# EAGLE design Bus Controller (EAGLE 5.01)
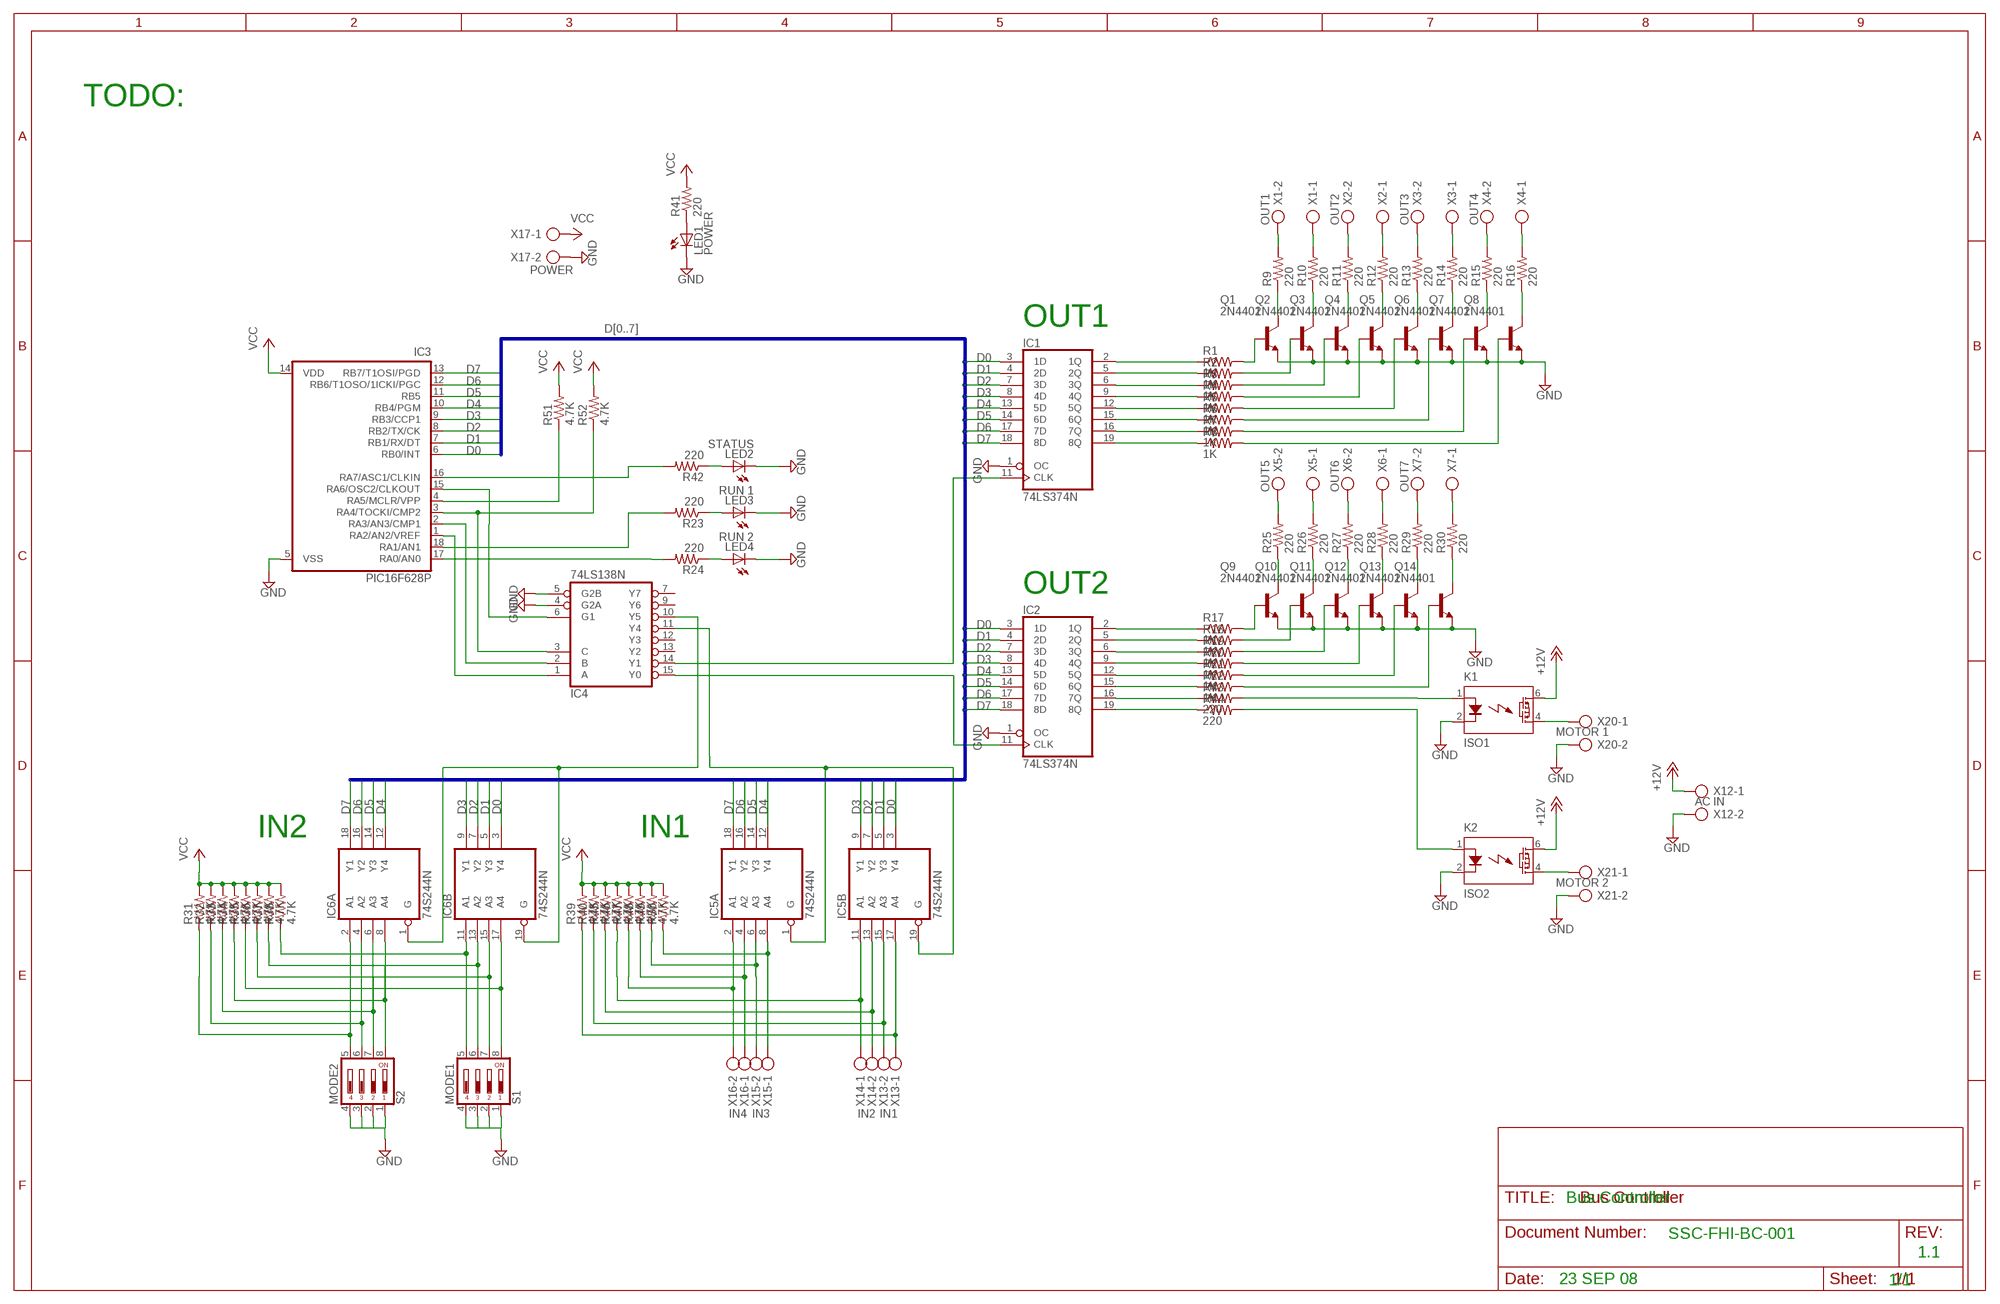
[diagram p0: schematic, sheet 1]

## Parts
IC1  74LS374N  [DIL20]
IC2  74LS374N  [DIL20]
IC3  PIC16F628P  [DIL18]
IC4  74LS138N  [DIL16]
IC5  74S244N  [DIL20]
IC6  74S244N  [DIL20]
K1  ISO1  LCA110  [DIL06]
K2  ISO2  LCA110  [DIL06]
LED1  POWER  LED5MM  [LED5MM]
LED2  STATUS  LED5MM  [LED5MM]
LED3  RUN 1  LED5MM  [LED5MM]
LED4  RUN 2  LED5MM  [LED5MM]
Q1  2N4401  [TO92-CBE]
Q2  2N4401  [TO92-CBE]
Q3  2N4401  [TO92-CBE]
Q4  2N4401  [TO92-CBE]
Q5  2N4401  [TO92-CBE]
Q6  2N4401  [TO92-CBE]
Q7  2N4401  [TO92-CBE]
Q8  2N4401  [TO92-CBE]
Q9  2N4401  [TO92-CBE]
Q10  2N4401  [TO92-CBE]
Q11  2N4401  [TO92-CBE]
Q12  2N4401  [TO92-CBE]
Q13  2N4401  [TO92-CBE]
Q14  2N4401  [TO92-CBE]
R1  1K  R-US_0207/2V  [0207/2V]
R2  1K  R-US_0207/2V  [0207/2V]
R3  1K  R-US_0207/2V  [0207/2V]
R4  1K  R-US_0207/2V  [0207/2V]
R5  1K  R-US_0207/2V  [0207/2V]
R6  1K  R-US_0207/2V  [0207/2V]
R7  1K  R-US_0207/2V  [0207/2V]
R8  1K  R-US_0207/2V  [0207/2V]
R9  220  R-US_0207/2V  [0207/2V]
R10  220  R-US_0207/2V  [0207/2V]
R11  220  R-US_0207/2V  [0207/2V]
R12  220  R-US_0207/2V  [0207/2V]
R13  220  R-US_0207/2V  [0207/2V]
R14  220  R-US_0207/2V  [0207/2V]
R15  220  R-US_0207/2V  [0207/2V]
R16  220  R-US_0207/2V  [0207/2V]
R17  1K  R-US_0207/2V  [0207/2V]
R18  1K  R-US_0207/2V  [0207/2V]
R19  1K  R-US_0207/2V  [0207/2V]
R20  1K  R-US_0207/2V  [0207/2V]
R21  1K  R-US_0207/2V  [0207/2V]
R22  1K  R-US_0207/2V  [0207/2V]
R23  220  R-US_0207/2V  [0207/2V]
R24  220  R-US_0207/2V  [0207/2V]
R25  220  R-US_0207/2V  [0207/2V]
R26  220  R-US_0207/2V  [0207/2V]
R27  220  R-US_0207/2V  [0207/2V]
R28  220  R-US_0207/2V  [0207/2V]
R29  220  R-US_0207/2V  [0207/2V]
R30  220  R-US_0207/2V  [0207/2V]
R31  4.7K  R-US_0207/2V  [0207/2V]
R32  4.7K  R-US_0207/2V  [0207/2V]
R33  4.7K  R-US_0207/2V  [0207/2V]
R34  4.7K  R-US_0207/2V  [0207/2V]
R35  4.7K  R-US_0207/2V  [0207/2V]
R36  4.7K  R-US_0207/2V  [0207/2V]
R37  4.7K  R-US_0207/2V  [0207/2V]
R38  4.7K  R-US_0207/2V  [0207/2V]
R39  4.7K  R-US_0207/2V  [0207/2V]
R40  4.7K  R-US_0207/2V  [0207/2V]
R41  220  R-US_0207/2V  [0207/2V]
R42  220  R-US_0207/2V  [0207/2V]
R43  220  R-US_0207/2V  [0207/2V]
R44  220  R-US_0207/2V  [0207/2V]
R45  4.7K  R-US_0207/2V  [0207/2V]
R46  4.7K  R-US_0207/2V  [0207/2V]
R47  4.7K  R-US_0207/2V  [0207/2V]
R48  4.7K  R-US_0207/2V  [0207/2V]
R49  4.7K  R-US_0207/2V  [0207/2V]
R50  4.7K  R-US_0207/2V  [0207/2V]
R51  4.7K  R-US_0207/2V  [0207/2V]
R52  4.7K  R-US_0207/2V  [0207/2V]
S1  MODE1  DS04  [DS-04]
S2  MODE2  DS04  [DS-04]
X1  OUT1  AK500/2  [AK500/2]
X2  OUT2  AK500/2  [AK500/2]
X3  OUT3  AK500/2  [AK500/2]
X4  OUT4  AK500/2  [AK500/2]
X5  OUT5  AK500/2  [AK500/2]
X6  OUT6  AK500/2  [AK500/2]
X7  OUT7  AK500/2  [AK500/2]
X12  AC IN  AK500/2  [AK500/2]
X13  IN1  AK500/2  [AK500/2]
X14  IN2  AK500/2  [AK500/2]
X15  IN3  AK500/2  [AK500/2]
X16  IN4  AK500/2  [AK500/2]
X17  POWER  AK500/2  [AK500/2]
X20  MOTOR 1  AK500/2  [AK500/2]
X21  MOTOR 2  AK500/2  [AK500/2]

## Nets
+12V: K1.6(D1) K2.6(D1) X12.1
A0: IC3.1(RA2/AN2/VREF) IC4.1(A)
A1: IC3.2(RA3/AN3/CMP1) IC4.2(B)
A2: IC3.3(RA4/TOCKI/CMP2) IC4.3(C) R52.1
ADDR_EN: IC3.15(RA6/OSC2/CLKOUT) IC4.6(G1)
D0: IC1.3(1D) IC2.3(1D) IC3.6(RB0/INT) IC5.3(B:Y4) IC6.3(B:Y4)
D1: IC1.4(2D) IC2.4(2D) IC3.7(RB1/RX/DT) IC5.5(B:Y3) IC6.5(B:Y3)
D2: IC1.7(3D) IC2.7(3D) IC3.8(RB2/TX/CK) IC5.7(B:Y2) IC6.7(B:Y2)
D3: IC1.8(4D) IC2.8(4D) IC3.9(RB3/CCP1) IC5.9(B:Y1) IC6.9(B:Y1)
D4: IC1.13(5D) IC2.13(5D) IC3.10(RB4/PGM) IC5.12(A:Y4) IC6.12(A:Y4)
D5: IC1.14(6D) IC2.14(6D) IC3.11(RB5) IC5.14(A:Y3) IC6.14(A:Y3)
D6: IC1.17(7D) IC2.17(7D) IC3.12(RB6/T1OSO/1ICKI/PGC) IC5.16(A:Y2) IC6.16(A:Y2)
D7: IC1.18(8D) IC2.18(8D) IC3.13(RB7/T1OSI/PGD) IC5.18(A:Y1) IC6.18(A:Y1)
GND: IC1.1(OC) IC2.1(OC) IC3.5(VSS) IC4.4(G2A) IC4.5(G2B) K1.2(K) K2.2(K) LED1.K(C) LED2.K(C) LED3.K(C) LED4.K(C) Q1.E Q2.E Q3.E Q4.E Q5.E Q6.E Q7.E Q8.E Q9.E Q10.E Q11.E Q12.E Q13.E Q14.E S1.1 S1.2 S1.3 S1.4 S2.1 S2.2 S2.3 S2.4 X12.2 X17.2 X20.2 X21.2
IN1: IC5.8(A:A4) R50.1 X15.1
IN2: IC5.6(A:A3) R49.1 X15.2
IN3: IC5.4(A:A2) R48.1 X16.1
IN4: IC5.2(A:A1) R47.1 X16.2
IN5: IC5.17(B:A4) R39.1 X13.1
IN6: IC5.15(B:A3) R40.1 X13.2
IN7: IC5.13(B:A2) R45.1 X14.2
IN8: IC5.11(B:A1) R46.1 X14.1
IN9: IC6.8(A:A4) R34.1 S2.8
IN10: IC6.6(A:A3) R33.1 S2.7
IN11: IC6.4(A:A2) R32.1 S2.6
IN12: IC6.2(A:A1) R31.1 S2.5
IN13: IC6.17(B:A4) R35.1 S1.8
IN14: IC6.15(B:A3) R36.1 S1.7
IN15: IC6.13(B:A2) R37.1 S1.6
IN16: IC6.11(B:A1) R38.1 S1.5
N$1: IC3.18(RA1/AN1) R23.2
N$2: IC3.4(RA5/MCLR/VPP) R51.1
N$5: IC2.11(CLK) IC4.15(Y0)
N$6: IC1.11(CLK) IC4.14(Y1)
N$7: Q1.B R1.2
N$8: Q2.B R2.2
N$9: Q3.B R3.2
N$10: Q4.B R4.2
N$11: Q5.B R5.2
N$12: Q6.B R6.2
N$13: Q7.B R7.2
N$14: Q8.B R8.2
N$15: Q1.C R9.1
N$16: Q2.C R10.1
N$17: Q3.C R11.1
N$18: Q4.C R12.1
N$19: Q5.C R13.1
N$20: Q6.C R14.1
N$21: Q7.C R15.1
N$22: Q8.C R16.1
N$23: IC1.2(1Q) R1.1
N$24: IC1.5(2Q) R2.1
N$25: IC1.6(3Q) R3.1
N$26: IC1.9(4Q) R4.1
N$27: IC1.12(5Q) R5.1
N$28: IC1.15(6Q) R6.1
N$29: IC1.16(7Q) R7.1
N$30: IC1.19(8Q) R8.1
N$31: Q9.B R17.2
N$32: Q10.B R18.2
N$33: Q11.B R19.2
N$34: Q12.B R20.2
N$35: Q13.B R21.2
N$36: Q14.B R22.2
N$37: LED4.A R24.1
N$38: LED3.A R23.1
N$39: R9.2 X1.2
N$40: R10.2 X1.1
N$41: R11.2 X2.2
N$42: R16.2 X4.1
N$43: R25.2 X5.2
N$44: R27.2 X6.2
N$45: R29.2 X7.2
N$47: IC3.16(RA7/ASC1/CLKIN) R42.2
N$48: K1.4(D2) X20.1
N$49: IC3.17(RA0/AN0) R24.2
N$50: K2.4(D2) X21.1
N$55: IC2.2(1Q) R17.1
N$56: IC2.5(2Q) R18.1
N$57: IC2.6(3Q) R19.1
N$58: IC2.9(4Q) R20.1
N$59: IC2.12(5Q) R21.1
N$60: IC2.15(6Q) R22.1
N$61: IC2.16(7Q) R43.1
N$62: IC2.19(8Q) R44.1
N$65: Q14.C R30.1
N$66: Q13.C R29.1
N$67: Q12.C R28.1
N$68: Q11.C R27.1
N$69: Q10.C R26.1
N$70: Q9.C R25.1
N$71: LED1.A R41.1
N$80: R15.2 X4.2
N$81: R14.2 X3.1
N$98: R12.2 X2.1
N$99: R13.2 X3.2
N$100: R26.2 X5.1
N$101: R28.2 X6.1
N$102: R30.2 X7.1
N$105: IC4.10(Y5) IC6.1(A:G) IC6.19(B:G)
N$106: LED2.A R42.1
N$107: K1.1(A) R43.2
N$108: K2.1(A) R44.2
N$109: IC4.11(Y4) IC5.1(A:G) IC5.19(B:G)
VCC: IC3.14(VDD) R31.2 R32.2 R33.2 R34.2 R35.2 R36.2 R37.2 R38.2 R39.2 R40.2 R41.2 R45.2 R46.2 R47.2 R48.2 R49.2 R50.2 R51.2 R52.2 X17.1
Unconnected: IC4.7(Y7) IC4.9(Y6) IC4.12(Y3) IC4.13(Y2)

## Buses
D[0..7]

## Notes on the sheet
- TODO:
- OUT1
- OUT2
- IN2 | IN1
- Bus Controller
- SSC-FHI-BC-001
- 1.1
- 23 SEP 08 | 1/1

## Power pins joined to a net without a drawn wire
GND: IC1.10(GND) IC2.10(GND) IC4.8(GND) IC5.10(P:GND) IC6.10(P:GND)
VCC: IC1.20(VCC) IC2.20(VCC) IC4.16(VCC) IC5.20(P:VCC) IC6.20(P:VCC)

## Library data of the parts
IC1 IC2 = 74xx-us:74*374: Octal D type transparent LATCH, edge triggered
IC3 = microchip:PIC16*F62: FLASH-Based 8-Bit CMOS Microcontroller Source: http://ww1.microchip.com/downloads/en/DeviceDoc/40300C.pdf
IC4 = 74xx-eu:74*138: 3-line to 8-line DECODER/DEMULTIPLEXER
IC5 IC6 = 74xx-us:74*244: Octal BUFFER and LINE DRIVER, 3-state
K1 K2 = relay:LCA110: Solid state relay. Clare LCA110
LED1-LED4 = led:LED: LED OSRAM: - CHIPLED LG R971, LG N971, LY N971, LG Q971, LY Q971, LO R971, LY R971 LH N974, LH R974 LS Q976, LO Q976, LY Q976 LO Q996 - Hyper CHIPLED LW Q18S LB Q993, LB Q99A, LB R99A - SideLED LS A670, LO A670, LY A670, LG A670, LP A670 LB A673, LV A673, LT A673, LW A673 LH A674 LY A675 LS A676, LA A676, LO A676, LY A676, LW A676 LS A679, LY A679, LG A679 - Hyper Micro SIDELED® LS Y876, LA Y876, LO Y876, LY Y876 LT Y87S - SmartLED LW L88C, LW L88S LB L89C, LB L89S, LG L890 LS L89K, LO L89K, LY L89K LS L896, LA L896, LO L896, LY L896 - TOPLED LS T670, LO T670, LY T670, LG T670, LP T670 LSG T670, LSP T670, LSY T670, LOP T670, LYG T670 LG T671, LOG T671, LSG T671 LB T673, LV T673, LT T673, LW T673 LH T674 LS T676, LA T676, LO T676, LY T676, LB T676, LH T676, LSB T676, LW T676 LB T67C, LV T67C, LT T67C, LS T67K, LO T67K, LY T67K, LW E67C LS E67B, LA E67B, LO E67B, LY E67B, LB E67C, LV E67C, LT E67C LW T67C LS T679, LY T679, LG T679 LS T770, LO T770, LY T770, LG T770, LP T770 LB T773, LV T773, LT T773, LW T773 LH T774 LS E675, LA E675, LY E675, LS T675 LS T776, LA T776, LO T776, LY T776, LB T776 LHGB T686 LT T68C, LB T68C - Hyper Mini TOPLED® LB M676 - Mini TOPLED Santana® LG M470 LS M47K, LO M47K, LY M47K Source: http://www.osram.convergy.de - LUMILED® LXK2-PW12-R00, LXK2-PW12-S00, LXK2-PW14-U00, LXK2-PW14-V00 LXK2-PM12-R00, LXK2-PM12-S00, LXK2-PM14-U00 LXK2-PE12-Q00, LXK2-PE12-R00, LXK2-PE12-S00, LXK2-PE14-T00, LXK2-PE14-U00 LXK2-PB12-K00, LXK2-PB12-L00, LXK2-PB12-M00, LXK2-PB14-N00, LXK2-PB14-P00, LXK2-PB14-Q00 LXK2-PR12-L00, LXK2-PR12-M00, LXK2-PR14-Q00, LXK2-PR14-R00 LXK2-PD12-Q00, LXK2-PD12-R00, LXK2-PD12-S00 LXK2-PH12-R00, LXK2-PH12-S00 LXK2-PL12-P00, LXK2-PL12-Q00, LXK2-PL12-R00 Source: www.luxeon.com
Q1-Q14 = transistor-npn:2N4401: Small signal transistor
R1-R52 = resistor:R-US_: RESISTOR, American symbol
S1 S2 = switch-dil:DS04: DIL/CODE SWITCH
X1-X7 X12-X17 X20 X21 = con-ptr500:AK500/2: CONNECTOR

## Board
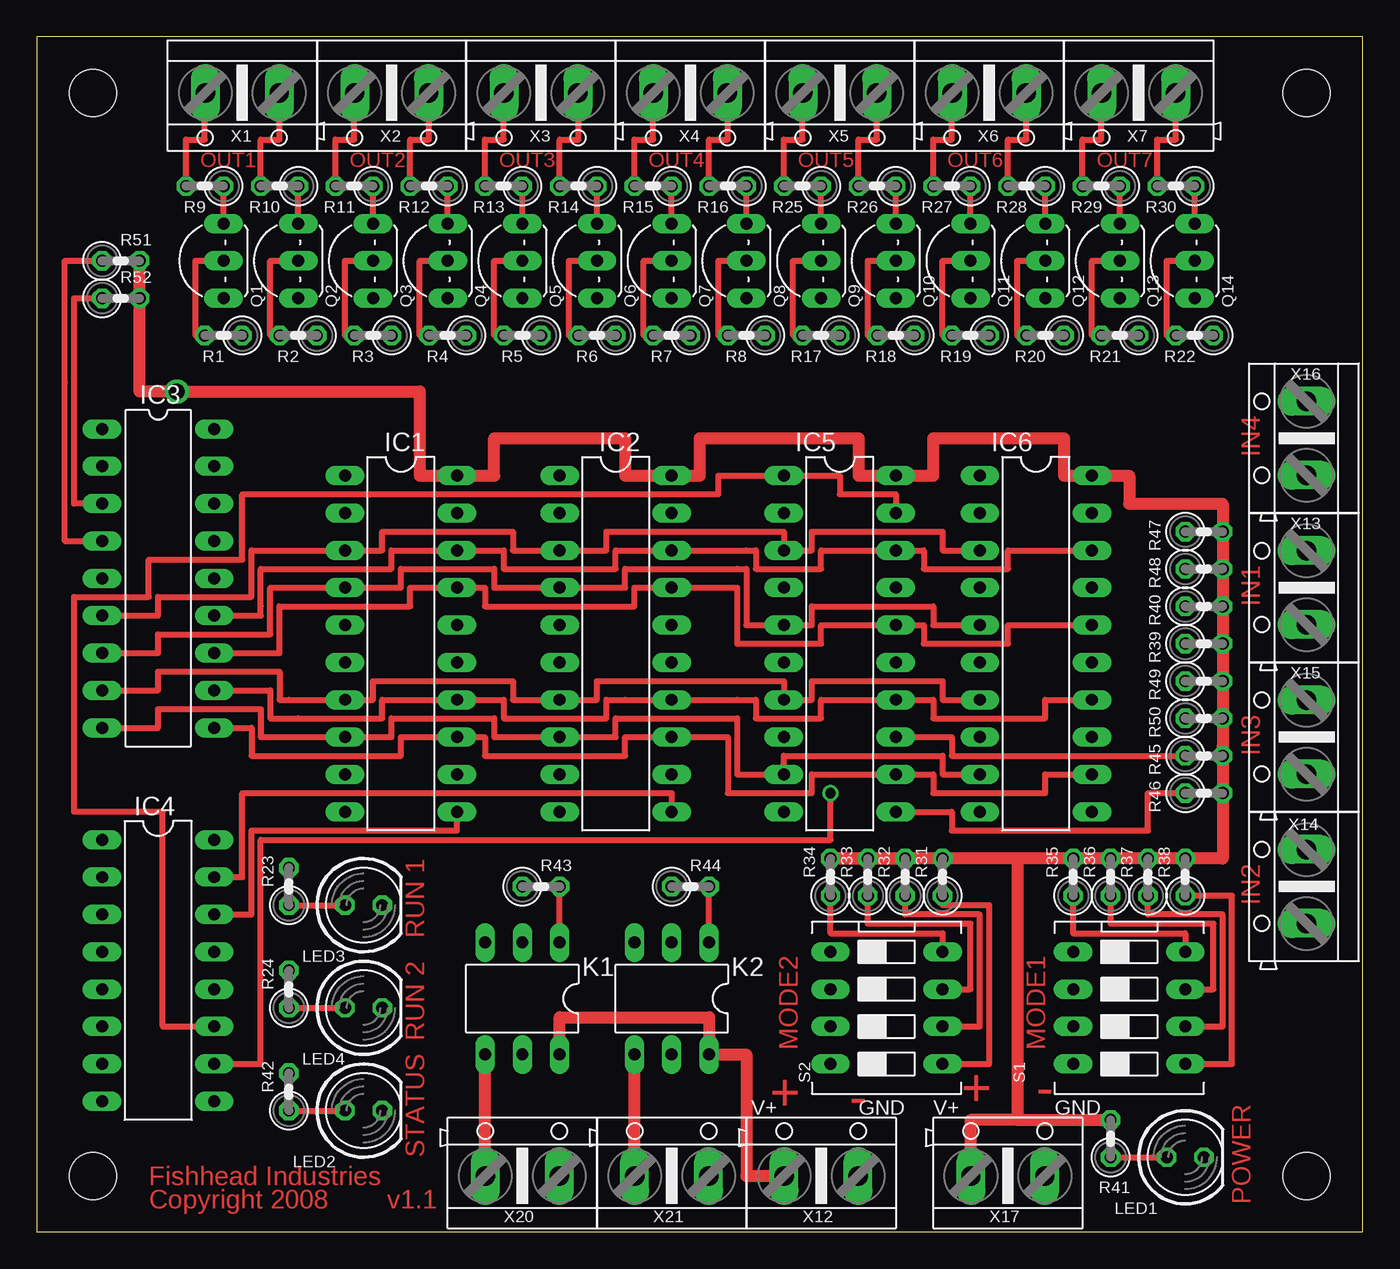
[diagram p1: board, top side]
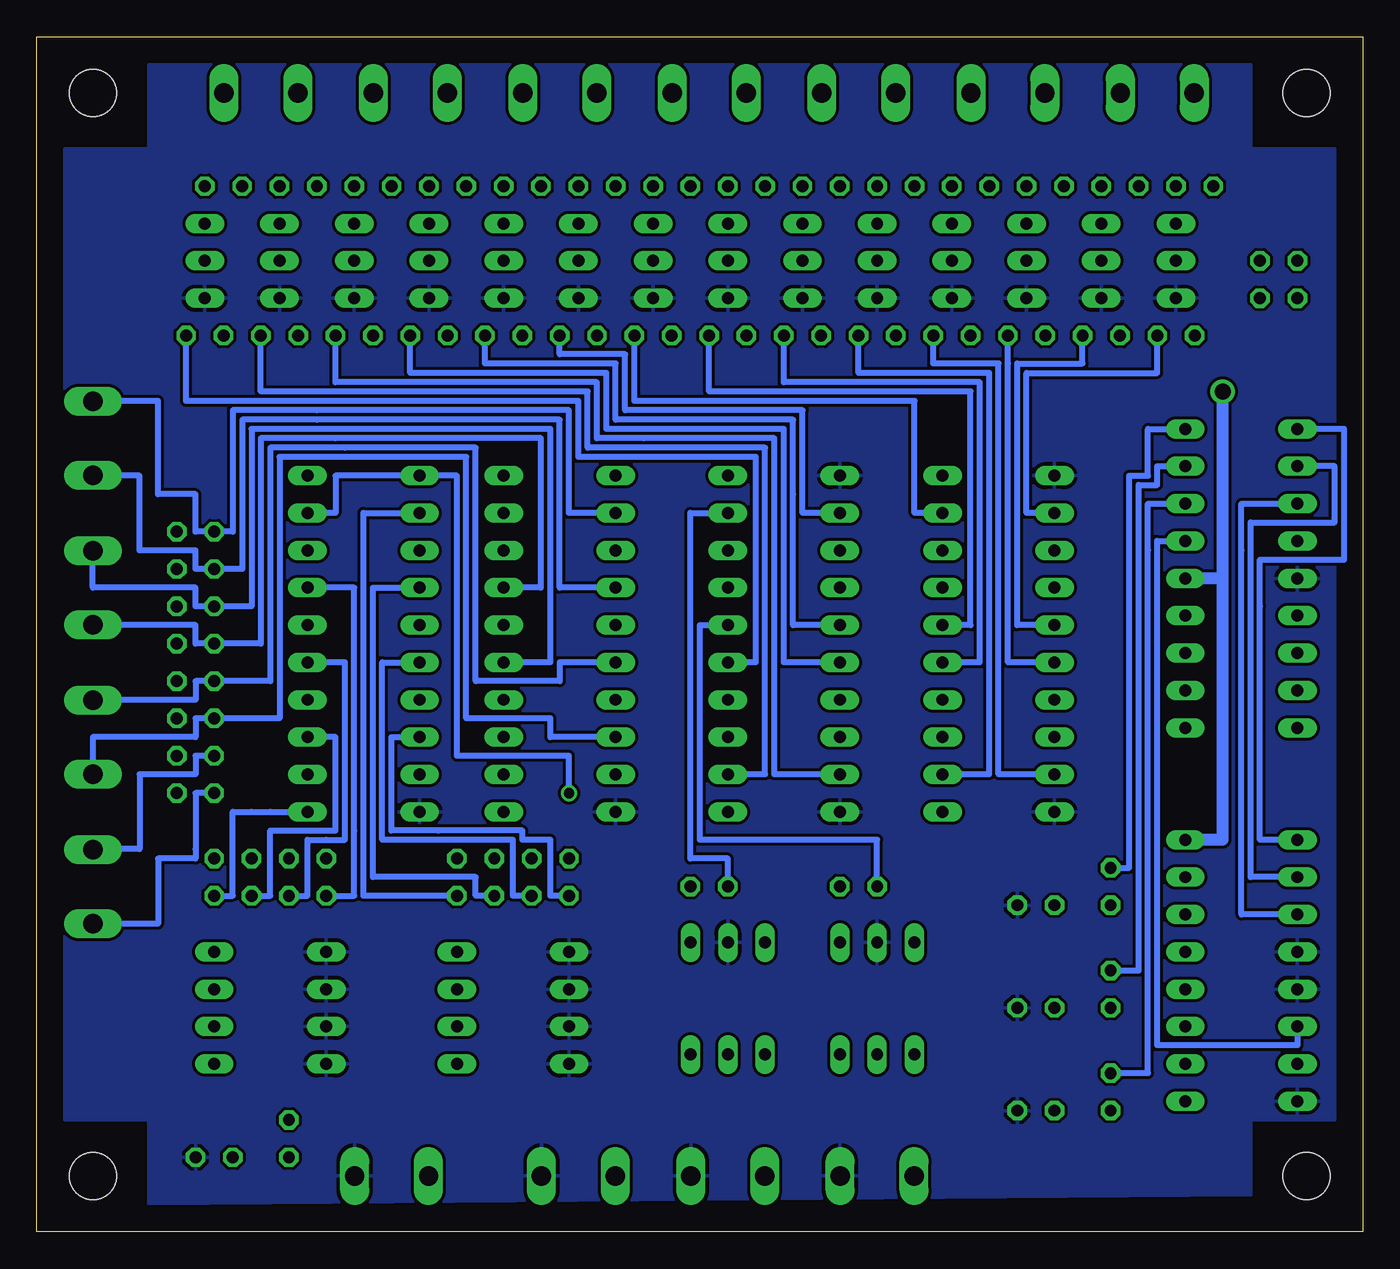
[diagram p2: board, bottom side, seen from below]

Size 90.17 x 81.28 mm. Coordinates in mm from the lower left corner, seen from the top.
Outline: 0,0 90.17,0 90.17,81.28 0,81.28 0,0
Copper layers (1*16): Top 0.035mm / dielectric 1.5mm / Bottom 0.035mm
Design rules "express_pcb *": minimum track width 8mil, minimum drill 20mil, track to track 8mil, track to pad 8mil, pad to pad 8mil, via to via 8mil, smd to smd 8mil, copper to edge 40mil, drill to drill 8mil, minimum pad ring 10mil, minimum via ring 8mil, stop-mask expansion 4mil, vias tented up to drill 0mil, thermal gap 10mil
Holes 3.2 mm at 3.81,77.47 3.81,3.81 86.36,77.47 86.36,3.81

### Footprints (pad centres in the part's own frame; a part is rotated, then mirrored left to right if it is on the bottom)
DIL20 = drill 0.813 long: 1 -11.43,-3.81; 2 -8.89,-3.81; 3 -6.35,-3.81; 4 -3.81,-3.81; 5 -1.27,-3.81; 6 1.27,-3.81; 7 3.81,-3.81; 8 6.35,-3.81; 9 8.89,-3.81; 10 11.43,-3.81; 11 11.43,3.81; 12 8.89,3.81; 13 6.35,3.81; 14 3.81,3.81; 15 1.27,3.81; 16 -1.27,3.81; 17 -3.81,3.81; 18 -6.35,3.81; 19 -8.89,3.81; 20 -11.43,3.81
DIL18 = drill 0.813 long: 1 -10.16,-3.81; 2 -7.62,-3.81; 3 -5.08,-3.81; 4 -2.54,-3.81; 5 0,-3.81; 6 2.54,-3.81; 7 5.08,-3.81; 8 7.62,-3.81; 9 10.16,-3.81; 10 10.16,3.81; 11 7.62,3.81; 12 5.08,3.81; 13 2.54,3.81; 14 0,3.81; 15 -2.54,3.81; 16 -5.08,3.81; 17 -7.62,3.81; 18 -10.16,3.81
DIL16 = drill 0.813 long: 1 -8.89,-3.81; 2 -6.35,-3.81; 3 -3.81,-3.81; 4 -1.27,-3.81; 5 1.27,-3.81; 6 3.81,-3.81; 7 6.35,-3.81; 8 8.89,-3.81; 9 8.89,3.81; 10 6.35,3.81; 11 3.81,3.81; 12 1.27,3.81; 13 -1.27,3.81; 14 -3.81,3.81; 15 -6.35,3.81; 16 -8.89,3.81
DIL06 = drill 0.813 long: 1 -2.54,-3.81; 2 0,-3.81; 3 2.54,-3.81; 4 2.54,3.81; 5 0,3.81; 6 -2.54,3.81
LED5MM = drill 0.813 octagon: A -1.27,0; K 1.27,0
TO92-CBE = drill 0.813 long: B 0,0; C 2.54,0; E -2.54,0
0207/2V = drill 0.813 octagon: 1 -1.27,0; 2 1.27,0
DS-04 = drill 0.813 long: 1 -3.81,-3.81; 2 -1.27,-3.81; 3 1.27,-3.81; 4 3.81,-3.81; 5 3.81,3.81; 6 1.27,3.81; 7 -1.27,3.81; 8 -3.81,3.81
AK500/2 = drill 1.321 long: 1 -2.515,0; 2 2.515,0

### Placement (x,y rotation side)
IC1  24.77,40.01 270 top
IC2  39.37,40.01 270 top
IC3  8.26,44.45 270 top
IC4  8.26,17.78 270 top
IC5  54.61,40.01 270 top
IC6  67.94,40.01 270 top
K1  33.02,15.88 180 top
K2  43.18,15.88 180 top
LED1  78.11,5.08 0 top
LED2  22.23,8.26 0 top
LED3  22.23,22.23 0 top
LED4  22.23,15.24 0 top
Q1  12.7,66.04 90 top
Q2  17.78,66.04 90 top
Q3  22.86,66.04 90 top
Q4  27.94,66.04 90 top
Q5  33.02,66.04 90 top
Q6  38.1,66.04 90 top
Q7  43.18,66.04 90 top
Q8  48.26,66.04 90 top
Q9  53.34,66.04 90 top
Q10  58.42,66.04 90 top
Q11  63.5,66.04 90 top
Q12  68.58,66.04 90 top
Q13  73.66,66.04 90 top
Q14  78.74,66.04 90 top
R1  12.7,60.96 180 top
R2  17.78,60.96 180 top
R3  22.86,60.96 180 top
R4  27.94,60.96 180 top
R5  33.02,60.96 180 top
R6  38.1,60.96 180 top
R7  43.18,60.96 180 top
R8  48.26,60.96 180 top
R9  11.43,71.12 180 top
R10  16.51,71.12 180 top
R11  21.59,71.12 180 top
R12  26.67,71.12 180 top
R13  31.75,71.12 180 top
R14  36.83,71.12 180 top
R15  41.91,71.12 180 top
R16  46.99,71.12 180 top
R17  53.34,60.96 180 top
R18  58.42,60.96 180 top
R19  63.5,60.96 180 top
R20  68.58,60.96 180 top
R21  73.66,60.96 180 top
R22  78.74,60.96 180 top
R23  17.14,23.5 90 top
R24  17.14,16.51 90 top
R25  52.07,71.12 180 top
R26  57.15,71.12 180 top
R27  62.23,71.12 180 top
R28  67.31,71.12 180 top
R29  72.39,71.12 180 top
R30  77.47,71.12 180 top
R31  61.59,24.13 90 top
R32  59.05,24.13 90 top
R33  56.52,24.13 90 top
R34  53.98,24.13 90 top
R35  70.48,24.13 90 top
R36  73.03,24.13 90 top
R37  75.56,24.13 90 top
R38  78.11,24.13 90 top
R39  79.38,40.01 0 top
R40  79.38,42.55 0 top
R41  73.03,6.35 90 top
R42  17.14,9.53 90 top
R43  34.29,23.5 0 top
R44  44.45,23.5 0 top
R45  79.38,32.38 0 top
R46  79.38,29.84 0 top
R47  79.38,47.62 0 top
R48  79.38,45.09 0 top
R49  79.38,37.47 0 top
R50  79.38,34.92 0 top
R51  5.71,66.04 0 top
R52  5.71,63.5 0 top
S1  74.3,15.24 270 top
S2  57.78,15.24 270 top
X1  13.97,77.47 180 top
X2  24.13,77.47 180 top
X3  34.29,77.47 180 top
X4  44.45,77.47 180 top
X5  54.61,77.47 180 top
X6  64.77,77.47 180 top
X7  74.93,77.47 180 top
X12  53.34,3.81 0 top
X13  86.36,43.81 90 top
X14  86.36,23.5 90 top
X15  86.36,33.66 90 top
X16  86.36,53.98 90 top
X17  66.04,3.81 0 top
X20  33.02,3.81 0 top
X21  43.18,3.81 0 top

### Tracks (layer width: path | path; a pad name or v marks a point on that pad's centre or on a via)
+12V
  Top 0.813: K1.6 35.56,14.61 45.72,14.61 K2.6 48.26,12.06 48.26,3.81 X12.1
A0
  Bottom 0.406: IC4.1 6.99,26.67 6.99,42.55 6.99,45.72 1.27,45.72 1.27,54.61 IC3.1
A1
  Bottom 0.406: IC4.2 7.62,24.13 7.62,48.26 1.91,48.26 1.91,52.07 IC3.2
A2
  Top 0.406: R52.1 2.54,63.5 2.54,49.53 IC3.3
  Bottom 0.406: IC4.3 8.26,21.59 8.26,46.35 8.26,49.53 | 8.26,49.53 7.62,49.53 | 7.62,49.53 IC3.3 | 8.26,49.53 7.62,49.53
ADDR_EN
  Bottom 0.406: IC3.15 13.97,46.99 13.97,45.72 13.97,29.21 13.97,17.78 13.97,12.7 4.45,12.7 IC4.6
D0
  Top 0.406: IC3.6 8.26,41.91 8.26,43.18 14.61,43.18 14.61,46.35 IC1.3 23.5,46.35 23.5,47.62 29.21,47.62 32.38,47.62 32.38,46.35 IC2.3 38.73,46.35 38.73,47.62 50.8,47.62 IC5.3 52.7,46.35 52.7,47.62 61.59,47.62 61.59,46.35 IC6.3
D1
  Top 0.406: IC3.7 8.26,39.37 8.26,40.64 15.88,40.64 15.88,43.81 22.23,43.81 IC1.4 24.77,43.81 24.77,45.09 31.11,45.09 31.11,43.81 IC2.4 40.01,43.81 40.01,45.09 47.62,45.09 48.26,45.09 48.26,41.27 IC5.5 52.7,41.27 52.7,42.55 60.96,42.55 60.96,41.27 IC6.5
D2
  Top 0.406: IC3.8 8.26,36.83 8.26,38.1 16.51,38.1 16.51,36.2 17.14,36.2 IC1.7 22.86,36.2 22.86,37.47 32.38,37.47 32.38,36.2 IC2.7 38.1,36.2 38.1,37.47 47.62,37.47 50.8,37.47 IC5.7 52.7,36.2 52.7,37.47 61.59,37.47 61.59,36.2 IC6.7
D3
  Top 0.406: IC3.9 8.26,34.29 8.26,35.56 15.24,35.56 15.24,33.66 IC1.8 24.13,33.66 24.13,34.92 31.11,34.92 31.11,33.66 IC2.8 39.37,33.66 39.37,34.92 47.62,34.92 47.62,31.11 IC5.9 50.8,32.38 61.59,32.38 61.59,31.11 IC6.9
D4
  Top 0.406: IC3.10 14.61,34.29 14.61,32.38 24.77,32.38 24.77,33.66 IC1.13 30.48,33.66 30.48,32.38 40.01,32.38 40.01,33.66 IC2.13 46.99,33.66 46.99,29.84 52.7,29.84 52.7,31.11 IC5.12 60.96,31.11 60.96,29.84 68.58,29.84 68.58,31.11 IC6.12
D5
  Top 0.406: IC1.14 23.5,36.2 23.5,34.92 17.78,34.92 15.88,34.92 15.88,36.83 IC3.11 | IC1.14 29.84,36.2 | IC1.14 31.75,36.2 31.75,34.92 38.73,34.92 38.73,36.2 40.01,36.2 IC2.14 47.62,36.2 48.9,36.2 48.9,34.92 53.34,34.92 53.34,36.2 IC5.14 60.96,36.2 60.96,34.92 68.58,34.92 68.58,36.2 IC6.14
D6
  Top 0.406: IC3.12 16.51,39.37 16.51,42.55 25.4,42.55 25.4,43.81 IC1.17 30.48,43.81 30.48,42.55 40.64,42.55 40.64,43.81 IC2.17 46.99,43.81 47.62,43.81 47.62,40.64 47.62,40.01 53.34,40.01 53.34,41.27 IC5.16 60.33,41.27 60.33,40.01 66.04,40.01 66.04,41.27 IC6.16
D7
  Top 0.406: IC3.13 15.24,41.91 15.24,42.55 15.24,45.09 24.13,45.09 24.13,46.35 IC1.18 31.75,46.35 31.75,45.09 39.37,45.09 39.37,46.35 IC2.18 48.26,46.35 48.9,46.35 48.9,45.09 53.34,45.09 53.34,46.35 IC5.18 60.33,46.35 60.33,45.09 66.04,45.09 66.04,46.35 IC6.18
GND
  pour Bottom: 7.62,2.54 7.62,7.62 1.91,7.62 1.91,73.66 7.62,73.66 7.62,79.38 82.55,79.38 82.55,73.66 88.27,73.66 88.27,7.62 82.55,7.62 82.55,1.91
IN1
  Bottom 0.406: IC5.8 55.24,33.66 55.24,34.92 60.96,34.92 60.96,52.7 68.58,52.7 73.66,52.7 73.66,34.92 R50.1 79.38,34.92 79.38,33.66 86.36,33.66 86.36,31.11 X15.1
IN2
  Bottom 0.406: IC5.6 54.61,38.73 54.61,37.47 60.33,37.47 60.33,53.34 69.22,53.34 74.3,53.34 74.3,37.47 R49.1 79.38,37.47 79.38,36.2 86.36,36.2 X15.2
IN3
  Bottom 0.406: IC5.4 54.61,43.81 54.61,55.24 71.12,55.24 76.2,55.24 76.2,45.09 R48.1 79.38,45.09 79.38,46.35 83.19,46.35 83.19,51.44 86.36,51.44 X16.1
IN4
  Bottom 0.406: IC5.2 53.98,48.9 53.98,55.88 71.12,55.88 76.83,55.88 76.83,47.62 R47.1 79.38,47.62 79.38,50.16 81.92,50.16 81.92,56.52 86.36,56.52 X16.2
IN5
  Bottom 0.406: IC5.17 55.88,43.81 55.88,53.98 69.85,53.98 74.93,53.98 74.93,40.01 R39.1 79.38,40.01 79.38,41.27 86.36,41.27 X13.1
IN6
  Bottom 0.406: IC5.15 55.24,38.73 55.24,54.61 70.48,54.61 75.56,54.61 75.56,42.55 R40.1 79.38,42.55 79.38,43.81 86.36,43.81 86.36,46.35 X13.2
IN7
  Top 0.406: IC5.13 62.23,33.66 62.23,32.38 R45.1
  Bottom 0.406: R45.1 79.38,32.38 79.38,31.11 83.19,31.11 83.19,26.04 86.36,26.04 X14.2
IN8
  Top 0.406: IC5.11 62.23,28.57 62.23,27.3 75.56,27.3 75.56,29.84 R46.1
  Bottom 0.406: R46.1 79.38,29.84 79.38,26.04 79.38,25.4 81.92,25.4 81.92,20.95 86.36,20.95 X14.1
IN9
  Top 0.406: S2.8 61.59,20.32 53.98,20.32 R34.1
  Bottom 0.406: IC6.8 66.04,33.66 66.04,27.3 62.87,27.3 57.15,27.3 57.15,26.67 55.24,26.67 55.24,22.86 R34.1
IN10
  Top 0.406: S2.7 63.5,16.51 63.5,20.95 56.52,20.95 R33.1
  Bottom 0.406: IC6.6 66.67,38.73 66.67,26.67 57.78,26.67 57.78,22.86 R33.1
IN11
  Top 0.406: S2.6 64.14,13.97 64.14,21.59 59.05,21.59 R32.1
  Bottom 0.406: IC6.4 67.31,43.81 67.31,24.13 60.33,24.13 60.33,22.86 R32.1
IN12
  Top 0.406: S2.5 64.77,11.43 64.77,22.23 61.59,22.23 R31.1
  Bottom 0.406: IC6.2 67.94,48.9 67.94,22.86 R31.1
IN13
  Top 0.406: S1.8 78.11,20.32 70.48,20.32 R35.1
  Bottom 0.406: R35.1 68.58,22.86 68.58,27.3 68.58,43.81 IC6.17
IN14
  Top 0.406: S1.7 80.01,16.51 80.01,20.95 73.03,20.95 R36.1
  Bottom 0.406: R36.1 71.75,22.86 71.75,26.67 70.48,26.67 69.22,26.67 69.22,38.73 IC6.15
IN15
  Top 0.406: S1.6 80.64,13.97 80.64,21.59 75.56,21.59 R37.1
  Bottom 0.406: R37.1 74.3,22.86 74.3,27.3 73.03,27.3 69.85,27.3 69.85,33.66 IC6.13
IN16
  Top 0.406: S1.5 81.28,11.43 81.28,22.86 R38.1
  Bottom 0.406: R38.1 76.83,22.86 76.83,28.57 75.56,28.57 74.3,28.57 IC6.11
N$1
  Bottom 0.406: R23.2 15.88,24.77 15.88,50.16 15.88,51.44 14.61,51.44 14.61,54.61 IC3.18
N$2
  Top 0.406: IC3.4 1.91,46.99 1.91,57.78 1.91,66.04 R51.1
N$5
  Top 0.406: IC4.15 13.97,24.13 13.97,29.84 43.18,29.84 IC2.11
N$6
  Top 0.406: IC4.14 14.61,21.59 14.61,27.3 28.57,27.3 IC1.11
N$7
  Top 0.406: R1.2 10.79,60.96 10.79,66.04 Q1.B
N$8
  Top 0.406: R2.2 15.88,60.96 15.88,66.04 Q2.B
N$9
  Top 0.406: R3.2 20.95,60.96 20.95,66.04 Q3.B
N$10
  Top 0.406: R4.2 26.04,60.96 26.04,66.04 Q4.B
N$11
  Top 0.406: R5.2 31.11,60.96 31.11,66.04 Q5.B
N$12
  Top 0.406: R6.2 36.2,60.96 36.2,66.04 Q6.B
N$13
  Top 0.406: R7.2 41.27,60.96 41.27,66.04 Q7.B
N$14
  Top 0.406: R8.2 46.35,60.96 46.35,65.41 46.35,66.04 Q8.B
N$15
  Top 0.406: Q1.C R9.1
N$16
  Top 0.406: Q2.C R10.1
N$17
  Top 0.406: Q3.C R11.1
N$18
  Top 0.406: Q4.C R12.1
N$19
  Top 0.406: Q5.C R13.1
N$20
  Top 0.406: Q6.C R14.1
N$21
  Top 0.406: Q7.C R15.1
N$22
  Top 0.406: Q8.C R16.1
N$23
  Bottom 0.406: IC1.2 22.86,48.9 22.86,58.42 13.97,58.42 R1.1
N$24
  Bottom 0.406: IC1.5 23.5,41.27 23.5,59.05 19.05,59.05 R2.1
N$25
  Bottom 0.406: IC1.6 24.13,38.73 24.13,59.05 R3.1
N$26
  Bottom 0.406: IC1.9 24.77,31.11 24.77,59.05 29.21,59.05 R4.1
N$27
  Bottom 0.406: IC1.12 25.4,31.11 25.4,58.42 34.29,58.42 R5.1
N$28
  Bottom 0.406: IC1.15 26.04,38.73 26.04,57.78 39.37,57.78 R6.1
N$29
  Bottom 0.406: R7.1 44.45,57.15 26.67,57.15 26.67,41.27 IC1.16
N$30
  Bottom 0.406: R8.1 49.53,56.52 30.48,56.52 30.48,48.9 IC1.19
N$31
  Top 0.406: R17.2 51.44,60.96 51.44,66.04 Q9.B
N$32
  Top 0.406: R18.2 56.52,60.96 56.52,66.04 Q10.B
N$33
  Top 0.406: R19.2 61.59,60.96 61.59,66.04 Q11.B
N$34
  Top 0.406: R20.2 66.67,60.96 66.67,66.04 Q12.B
N$35
  Top 0.406: R21.2 71.75,60.96 71.75,66.04 Q13.B
N$36
  Top 0.406: R22.2 76.83,60.96 76.83,66.04 Q14.B
N$37
  Top 0.406: R24.1 LED4.A
N$38
  Top 0.406: R23.1 LED3.A
N$39
  Top 0.406: R9.2 10.16,74.3 11.43,74.3 11.43,77.47 X1.2
N$40
  Top 0.406: R10.2 15.24,74.3 16.51,74.3 16.51,77.47 X1.1
N$41
  Top 0.406: R11.2 20.32,74.3 21.59,74.3 21.59,77.47 X2.2
N$42
  Top 0.406: R16.2 45.72,74.3 46.99,74.3 46.99,77.47 X4.1
N$43
  Top 0.406: R25.2 50.8,74.3 52.07,74.3 52.07,77.47 X5.2
N$44
  Top 0.406: R27.2 60.96,74.3 62.23,74.3 62.23,76.83 62.23,77.47 X6.2
N$45
  Top 0.406: R29.2 71.12,74.3 72.39,74.3 72.39,77.47 X7.2
N$47
  Bottom 0.406: R42.2 14.61,10.79 14.61,46.35 14.61,49.53 IC3.16
N$48
  Top 0.813: X20.1 30.48,3.81 K1.4
N$49
  Bottom 0.406: R24.2 15.24,17.78 15.24,48.9 15.24,50.8 13.97,50.8 13.97,52.07 IC3.17
N$50
  Top 0.813: X21.1 40.64,3.81 K2.4
N$55
  Bottom 0.406: IC2.2 38.1,48.9 38.1,55.88 50.16,55.88 50.16,59.69 54.61,59.69 R17.1
N$56
  Bottom 0.406: IC2.5 38.73,41.27 38.73,50.16 38.73,55.24 50.8,55.24 50.8,59.05 59.69,59.05 R18.1
N$57
  Bottom 0.406: IC2.6 39.37,38.73 39.37,54.61 43.81,54.61 51.44,54.61 51.44,58.42 64.77,58.42 R19.1
N$58
  Bottom 0.406: IC2.9 40.01,31.11 40.01,53.98 48.9,53.98 52.07,53.98 52.07,57.78 69.85,57.78 R20.1
N$59
  Bottom 0.406: IC2.12 40.64,31.11 40.64,53.34 52.7,53.34 52.7,57.15 74.93,57.15 R21.1
N$60
  Bottom 0.406: IC2.15 41.27,38.73 41.27,52.7 53.34,52.7 53.34,56.52 80.01,56.52 R22.1
N$61
  Bottom 0.406: IC2.16 45.09,41.27 45.09,26.67 38.73,26.67 33.02,26.67 R43.1
N$62
  Bottom 0.406: IC2.19 45.72,48.9 45.72,25.4 43.18,25.4 R44.1
N$65
  Top 0.406: Q14.C R30.1
N$66
  Top 0.406: Q13.C R29.1
N$67
  Top 0.406: Q12.C R28.1
N$68
  Top 0.406: Q11.C R27.1
N$69
  Top 0.406: Q10.C R26.1
N$70
  Top 0.406: Q9.C R25.1
N$71
  Top 0.406: R41.1 LED1.A
N$80
  Top 0.406: R15.2 40.64,74.3 41.91,74.3 41.91,77.47 X4.2
N$81
  Top 0.406: R14.2 35.56,74.3 36.83,74.3 36.83,77.47 X3.1
N$98
  Top 0.406: R12.2 25.4,74.3 26.67,74.3 26.67,77.47 X2.1
N$99
  Top 0.406: R13.2 30.48,74.3 31.75,74.3 31.75,77.47 X3.2
N$100
  Top 0.406: R26.2 55.88,74.3 57.15,74.3 57.15,77.47 X5.1
N$101
  Top 0.406: R28.2 66.04,74.3 67.31,74.3 67.31,77.47 X6.1
N$102
  Top 0.406: R30.2 76.2,74.3 77.47,74.3 77.47,77.47 X7.1
N$105  (via drill 0.7)
  Top 0.406: IC4.10 15.24,11.43 15.24,26.67 53.98,26.67 53.98,29.21 v53.98,29.84
  Bottom 0.406: IC6.19 69.85,48.9 69.85,51.44 IC6.1 61.59,51.44 61.59,32.38 53.98,32.38 v53.98,29.84
N$106
  Top 0.406: R42.1 LED2.A
N$107
  Top 0.406: K1.1 R43.2
N$108
  Top 0.406: K2.1 R44.2
N$109
  Top 0.406: IC4.11 8.57,13.97 8.57,28.57 2.54,28.57 2.54,40.01 2.54,43.18 7.62,43.18 7.62,45.72 13.97,45.72 13.97,50.16 22.86,50.16 30.48,50.16 33.02,50.16 38.1,50.16 40.64,50.16 46.35,50.16 46.35,51.44 IC5.1 54.61,51.44 54.61,50.16 58.42,50.16 IC5.19
VCC  (via drill 1.1)
  Top 0.813: 66.67,7.62 63.5,7.62 | 66.67,7.62 R41.2 | 66.67,25.4 66.67,7.62 | 66.67,7.62 63.5,7.62 | X17.1 63.5,3.81 63.5,7.62 | R51.2 R52.2 6.99,57.15 v9.53,57.15 26.04,57.15 26.04,53.98 26.04,51.44 IC1.20 31.11,51.44 31.11,53.98 40.01,53.98 40.01,51.44 IC2.20 45.09,51.44 45.09,53.98 55.88,53.98 55.88,51.44 IC5.20 60.96,51.44 60.96,53.98 69.85,53.98 69.85,51.44 71.12,51.44 | 71.12,51.44 IC6.20 | 71.12,51.44 74.3,51.44 74.3,49.53 80.64,49.53 R47.2 R48.2 R40.2 R39.2 R49.2 R50.2 80.64,33.02 R45.2 R46.2 80.64,25.4 R38.2 R37.2 R36.2 R35.2 66.67,25.4 | 66.67,25.4 R31.2 R32.2 R33.2 R34.2 66.67,25.4
  Bottom 0.813: IC4.16 9.53,26.67 9.53,41.27 9.53,44.45 | 9.53,44.45 9.53,53.34 9.53,53.98 v9.53,57.15 | 9.53,44.45 IC3.14

### Text on the board
Top: OUT1 | OUT2 | OUT3 | OUT4 | OUT5 | OUT6 | OUT7 | IN4 | IN1 | IN3 | IN2 | RUN 1 | RUN 2 | MODE2 | MODE1 | + | - | + | - | STATUS | Fishhead Industries | Copyright 2008 | v1.1 | POWER
tPlace: V+ | GND | V+ | GND